# EAGLE design AB+RADIO (EAGLE 9.4.2)
ESKD_DESCRIPTION1: 207|235|224|242|224|32|192|193; ESKD_DESCRIPTION2: 241|245|229|236|224|32|253|235|229|234|242|240|232|247|229|241|234|224|255; ESKD_DESCRIPTION3: 239|240|232|237|246|232|239|232|224|235|252|237|224|255; ESKD_NUMBER: 67|67|83|50|46|51|50|48|48|45|48|221|51; ESKD_NUMBER_SHEET: 49; ESKD_SHEETS: 49
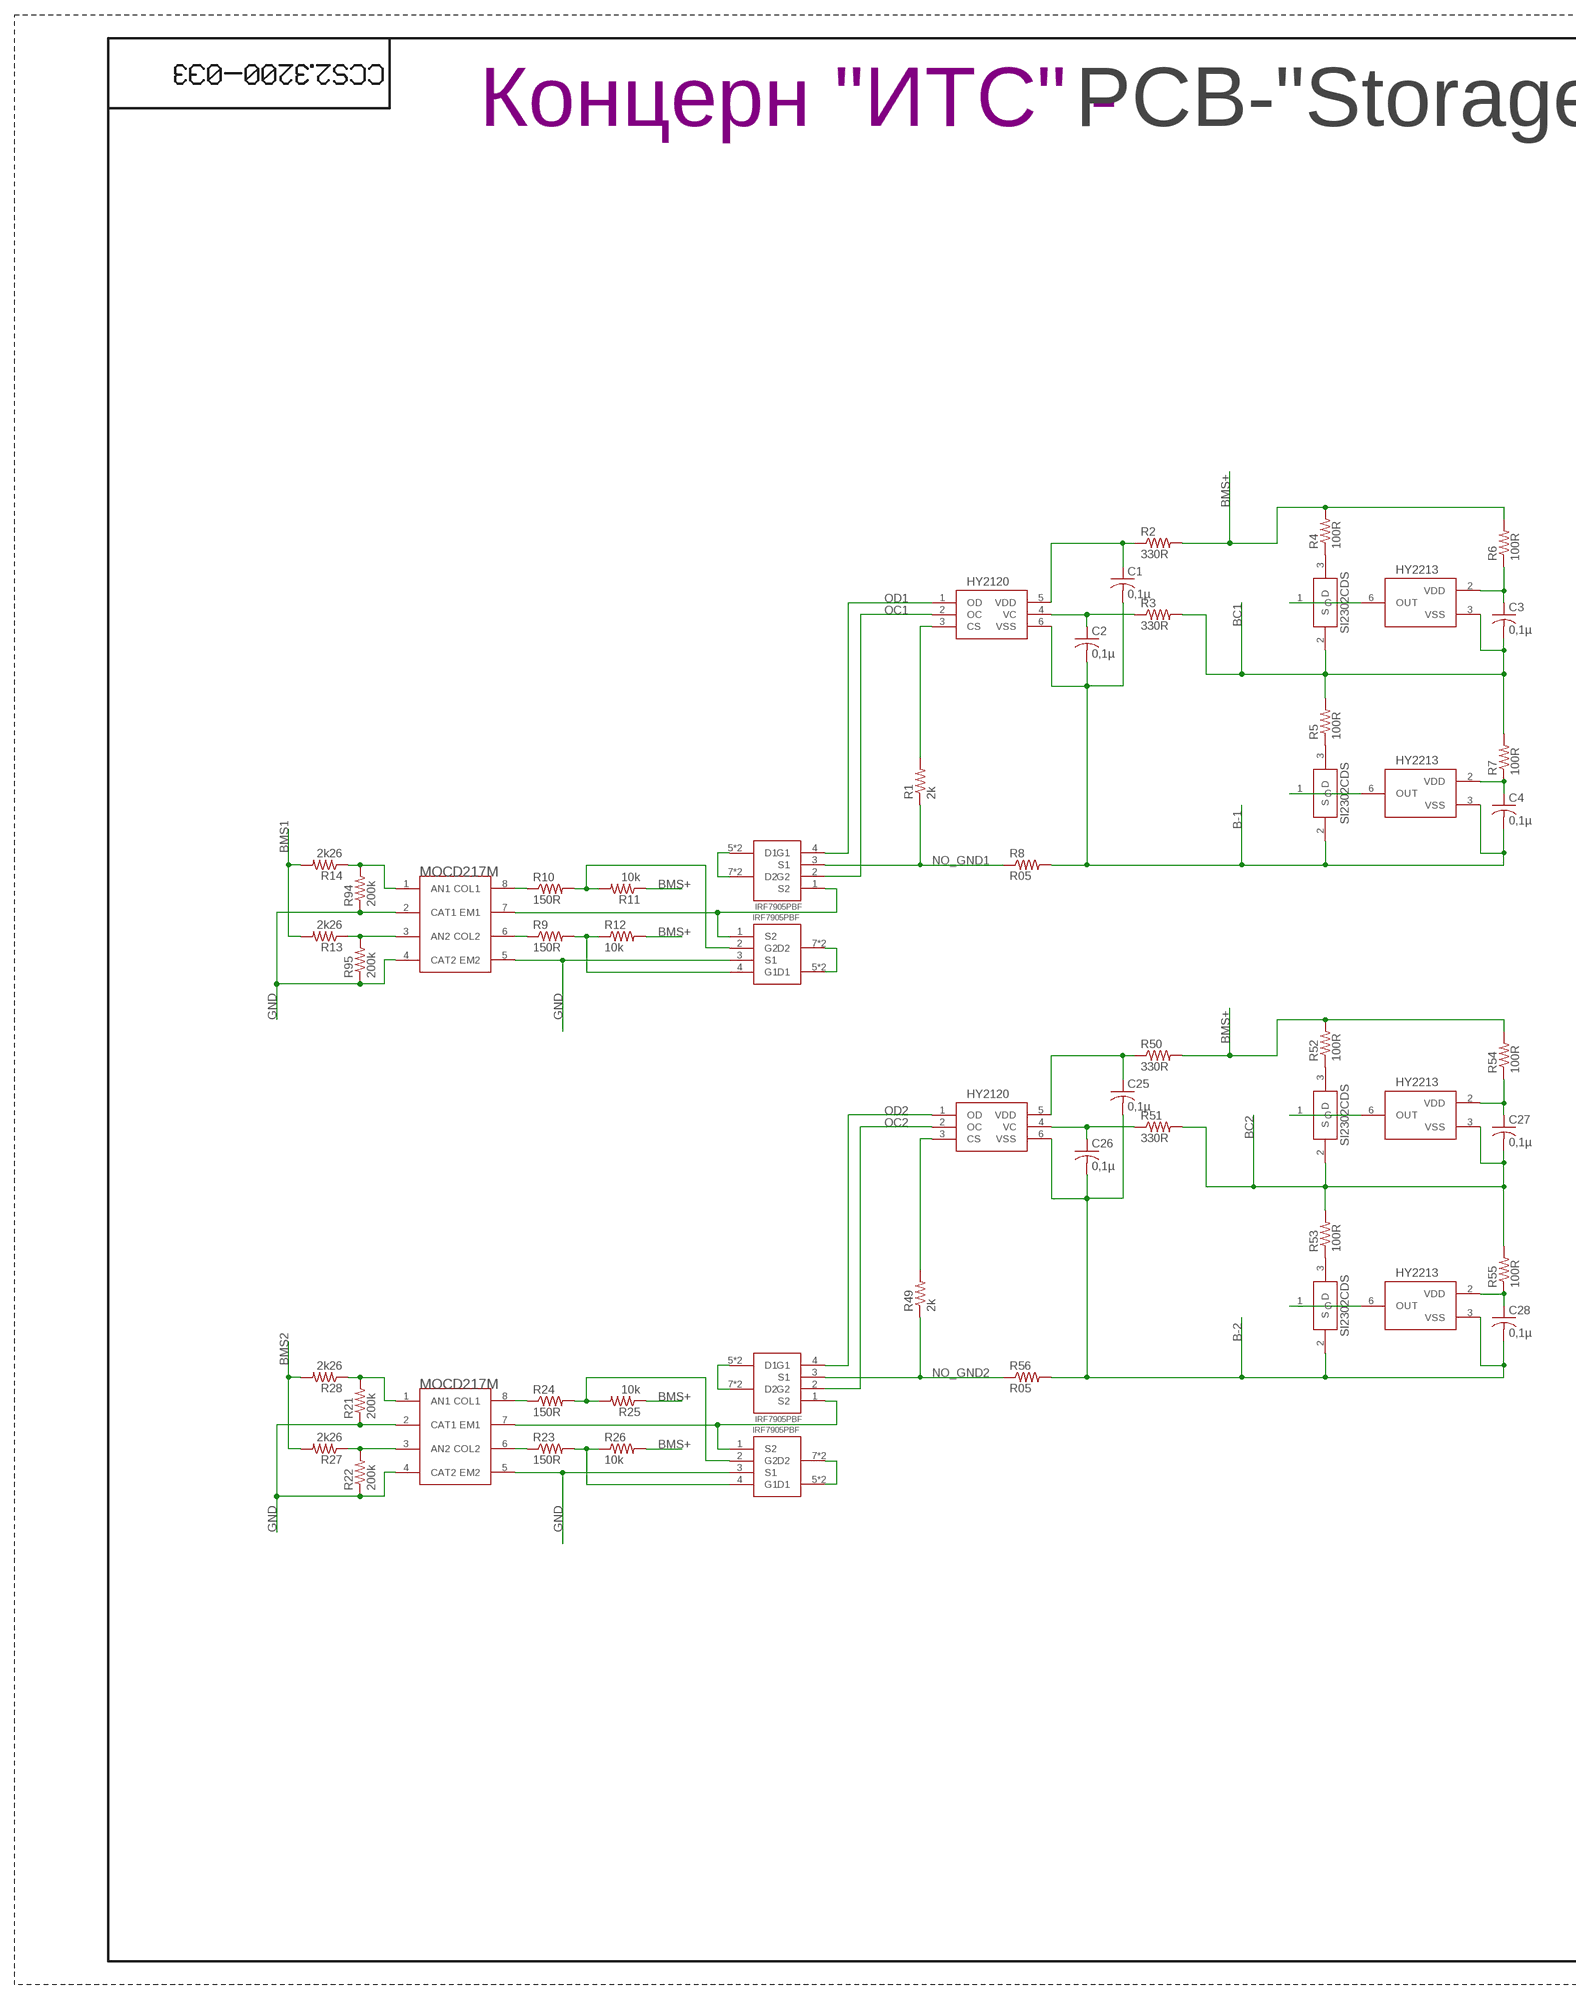
[diagram p0: schematic, sheet 1, part 1 of 2]
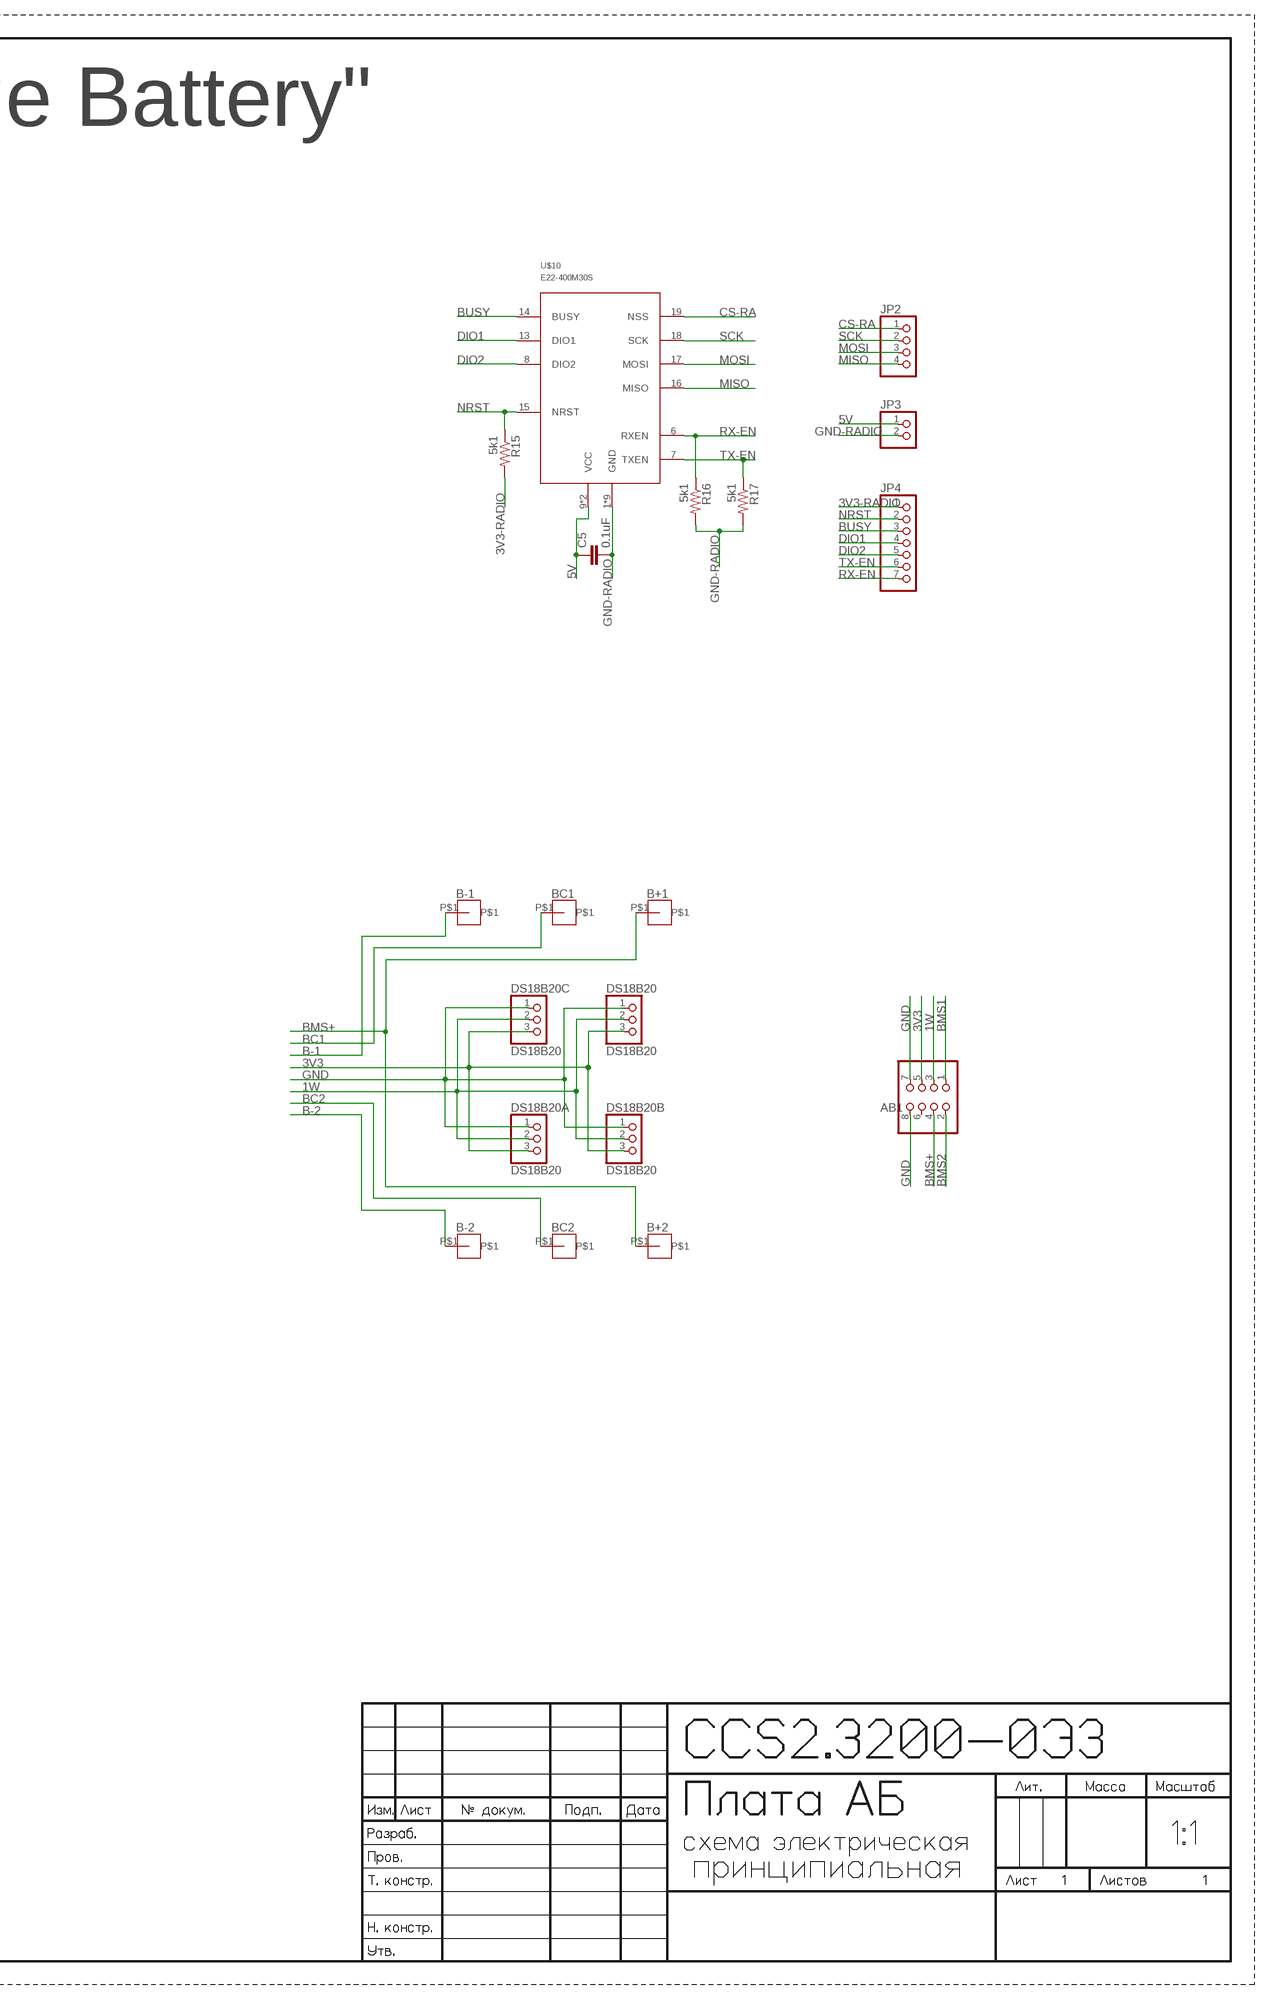
[diagram p1: schematic, sheet 1, part 2 of 2]

## Parts
AB1  PINHD-2X4  [2X04]
B+1  BATTERY  [BATTERY]
B+2  BATTERY  [BATTERY]
B-1  BATTERY  [BATTERY]
B-2  BATTERY  [BATTERY]
BC1  BATTERY  [BATTERY]
BC2  BATTERY  [BATTERY]
C1  0,1µ  C-USC0603  [C0603]
C2  0,1µ  C-USC0603  [C0603]
C3  0,1µ  C-USC0603  [C0603]
C4  0,1µ  C-USC0603  [C0603]
C5  0.1uF  C-EUC0603  [C0603]
C25  0,1µ  C-USC0603  [C0603]
C26  0,1µ  C-USC0603  [C0603]
C27  0,1µ  C-USC0603  [C0603]
C28  0,1µ  C-USC0603  [C0603]
DS18B20  DS18B20  CONNECT1X3  [CONNECT1X3]
DS18B20A  DS18B20  CONNECT1X3  [CONNECT1X3]
DS18B20B  DS18B20  CONNECT1X3  [CONNECT1X3]
DS18B20C  DS18B20  CONNECT1X3  [CONNECT1X3]
JP2  PINHD-1X4  [1X04]
JP3  PINHD-1X2  [1X02]
JP4  PINHD-1X7  [1X07]
R1  2k  R-US_R0603  [R0603]
R2  330R  R-US_R0603  [R0603]
R3  330R  R-US_R0603  [R0603]
R4  100R  R-US_R0603  [R0603]
R5  100R  R-US_R0603  [R0603]
R6  100R  R-US_R0603  [R0603]
R7  100R  R-US_R0603  [R0603]
R8  R05  R-US_R2512  [R2512]
R9  150R  R-US_R0603  [R0603]
R10  150R  R-US_R0603  [R0603]
R11  10k  R-US_R0603  [R0603]
R12  10k  R-US_R0603  [R0603]
R13  2k26  R-US_R0603  [R0603]
R14  2k26  R-US_R0603  [R0603]
R15  5k1  R-US_R0603  [R0603]
R16  5k1  R-US_R0603  [R0603]
R17  5k1  R-US_R0603  [R0603]
R21  200k  R-US_R0603  [R0603]
R22  200k  R-US_R0603  [R0603]
R23  150R  R-US_R0603  [R0603]
R24  150R  R-US_R0603  [R0603]
R25  10k  R-US_R0603  [R0603]
R26  10k  R-US_R0603  [R0603]
R27  2k26  R-US_R0603  [R0603]
R28  2k26  R-US_R0603  [R0603]
R49  2k  R-US_R0603  [R0603]
R50  330R  R-US_R0603  [R0603]
R51  330R  R-US_R0603  [R0603]
R52  100R  R-US_R0603  [R0603]
R53  100R  R-US_R0603  [R0603]
R54  100R  R-US_R0603  [R0603]
R55  100R  R-US_R0603  [R0603]
R56  R05  R-US_R2512  [R2512]
R94  200k  R-US_R0603  [R0603]
R95  200k  R-US_R0603  [R0603]
U$1  PCB-"Storage Battery"  ITS-LOGOPCB-""  [ITS-LOGO]
U$2  MOCD217M  [SOIC8]
U$3  HY2120  [SOT23-6]
U$4  HY2213"  [SOT23-6]
U$5  HY2213"  [SOT23-6]
U$6  SI2302CDS  [SOT23-3]
U$7  SI2302CDS  [SOT23-3]
U$8  IRF7905PBF  [SO8]
U$9  IRF7905PBF  [SO8]
U$10  E22-400M30S  [E22-400M30S]
U$11  MOCD217M  [SOIC8]
U$12  IRF7905PBF  [SO8]
U$13  IRF7905PBF  [SO8]
U$45  HY2120  [SOT23-6]
U$46  HY2213"  [SOT23-6]
U$47  HY2213"  [SOT23-6]
U$48  SI2302CDS  [SOT23-3]
U$49  SI2302CDS  [SOT23-3]

## Nets
1W: AB1.3 DS18B20.2 DS18B20A.2 DS18B20B.2 DS18B20C.2
3V3: AB1.5 DS18B20.3 DS18B20A.3 DS18B20B.3 DS18B20C.3
3V3-RADIO: JP4.1 R15.2
5V: C5.1 JP3.1 U$10.9(VCC) U$10.10(VCC)
B-1: B-1.P$1 C1.2 C2.2 C4.2 R8.2 U$3.6(VSS) U$5.3(VSS) U$7.2(S)
B-2: B-2.P$1 C25.2 C26.2 C28.2 R56.2 U$45.6(VSS) U$47.3(VSS) U$49.2(S)
BC1: BC1.P$1 C3.2 R3.2 R5.2 R7.2 U$4.3(VSS) U$6.2(S)
BC2: BC2.P$1 C27.2 R51.2 R53.2 R55.2 U$46.3(VSS) U$48.2(S)
BMS1: AB1.1 R13.2 R14.2
BMS2: AB1.2 R27.2 R28.2
BMS+: AB1.4 B+1.P$1 B+2.P$1 R2.2 R4.2 R6.2 R11.1 R12.2 R25.1 R26.2 R50.2 R52.2 R54.2
BUSY: JP4.3 U$10.14(BUSY)
CS-RA: JP2.1 U$10.19(NSS)
DIO1: JP4.4 U$10.13(DIO1)
DIO2: JP4.5 U$10.8(DIO2)
GND: AB1.7 AB1.8 DS18B20.1 DS18B20A.1 DS18B20B.1 DS18B20C.1 R21.1 R22.1 R94.1 R95.1 U$2.2(CAT1) U$2.4(CAT2) U$2.5(EM2) U$8.3(S1) U$11.2(CAT1) U$11.4(CAT2) U$11.5(EM2) U$12.3(S1)
GND-RADIO: C5.2 JP3.2 R16.2 R17.2 U$10.1(GND) U$10.2(GND) U$10.3(GND) U$10.4(GND) U$10.5(GND) U$10.11(GND) U$10.12(GND) U$10.20(GND) U$10.22(GND)
MISO: JP2.4 U$10.16(MISO)
MOSI: JP2.3 U$10.17(MOSI)
N$1: U$2.7(EM1) U$8.1(S2) U$9.1(S2)
N$2: R10.2 R11.2 U$8.2(G2)
N$3: R49.2 U$45.3(CS)
N$4: C1.1 R2.1 U$3.5(VDD)
N$6: C3.1 R6.1 U$4.2(VDD)
N$7: U$4.6(OUT) U$6.1(G)
N$8: C4.1 R7.1 U$5.2(VDD)
N$9: U$5.6(OUT) U$7.1(G)
N$11: R4.1 U$6.3(D)
N$12: R5.1 U$7.3(D)
N$13: R1.2 U$3.3(CS)
N$15: C2.1 R3.1 U$3.4(VC)
N$16: U$9.5(D1) U$9.6(D1) U$9.7(D2) U$9.8(D2)
N$17: R10.1 U$2.8(COL1)
N$18: R13.1 R95.2 U$2.3(AN2)
N$20: R22.2 R27.1 U$11.3(AN2)
N$21: U$8.5(D1) U$8.6(D1) U$8.7(D2) U$8.8(D2)
N$22: R9.1 U$2.6(COL2)
N$23: R9.2 R12.1 U$8.4(G1)
N$24: R21.2 R28.1 U$11.1(AN1)
N$25: R14.1 R94.2 U$2.1(AN1)
N$26: R24.2 R25.2 U$12.2(G2)
N$27: R24.1 U$11.8(COL1)
N$28: R23.1 U$11.6(COL2)
N$29: R23.2 R26.1 U$12.4(G1)
N$30: U$11.7(EM1) U$12.1(S2) U$13.1(S2)
N$31: U$13.5(D1) U$13.6(D1) U$13.7(D2) U$13.8(D2)
N$32: U$12.5(D1) U$12.6(D1) U$12.7(D2) U$12.8(D2)
N$71: R52.1 U$48.3(D)
N$85: R53.1 U$49.3(D)
N$97: C25.1 R50.1 U$45.5(VDD)
N$99: C27.1 R54.1 U$46.2(VDD)
N$100: U$46.6(OUT) U$48.1(G)
N$102: U$47.6(OUT) U$49.1(G)
N$107: C26.1 R51.1 U$45.4(VC)
N$108: C28.1 R55.1 U$47.2(VDD)
NO_GND1: R1.1 R8.1 U$9.3(S1)
NO_GND2: R49.1 R56.1 U$13.3(S1)
NRST: JP4.2 R15.1 U$10.15(NRST)
OC1: U$3.2(OC) U$9.2(G2)
OC2: U$13.2(G2) U$45.2(OC)
OD1: U$3.1(OD) U$9.4(G1)
OD2: U$13.4(G1) U$45.1(OD)
RX-EN: JP4.7 R16.1 U$10.6(RXEN)
SCK: JP2.2 U$10.18(SCK)
TX-EN: JP4.6 R17.1 U$10.7(TXEN)
Unconnected: AB1.6

## Library data of the parts
AB1 = pinheadCS:PINHD-2X4: PIN HEADER
B+1 B+2 B-1 B-2 BC1 BC2 = CanCubeSat:BATTERY
C1-C4 C25-C28 = rcl:C-US: CAPACITOR, American symbol; SPICEPREFIX: C
C5 = rcl:C-EU: CAPACITOR, European symbol; SPICEPREFIX: C
DS18B20 DS18B20A DS18B20B DS18B20C = CanCubeSat:CONNECT1X3
JP2 = pinhead:PINHD-1X4: PIN HEADER
JP3 = pinhead:PINHD-1X2: PIN HEADER
JP4 = pinhead:PINHD-1X7: PIN HEADER
R1-R7 R9-R17 R21-R28 R49-R55 R94 R95 = resistor:R-US_: RESISTOR, American symbol
R8 R56 = rcl:R-US_: RESISTOR, American symbol; SPICEPREFIX: R
U$1 = CanCubeSat:ITS-LOGO
U$2 U$11 = CanCubeSat:MOCD217M
U$3 U$45 = CanCubeSat:HY2120
U$4 U$5 U$46 U$47 = CanCubeSat:HY2213
U$6 U$7 U$48 U$49 = CanCubeSat:SI2302CDS
U$8 U$9 U$12 U$13 = CanCubeSat:IRF7905PBF
U$10 = CanCubeSat:E22-400M30S: EBYTE E22400M30S radio module Datasheet and info: http://www.ebyte.com/en/product-view-news.aspx?id=454

## Board
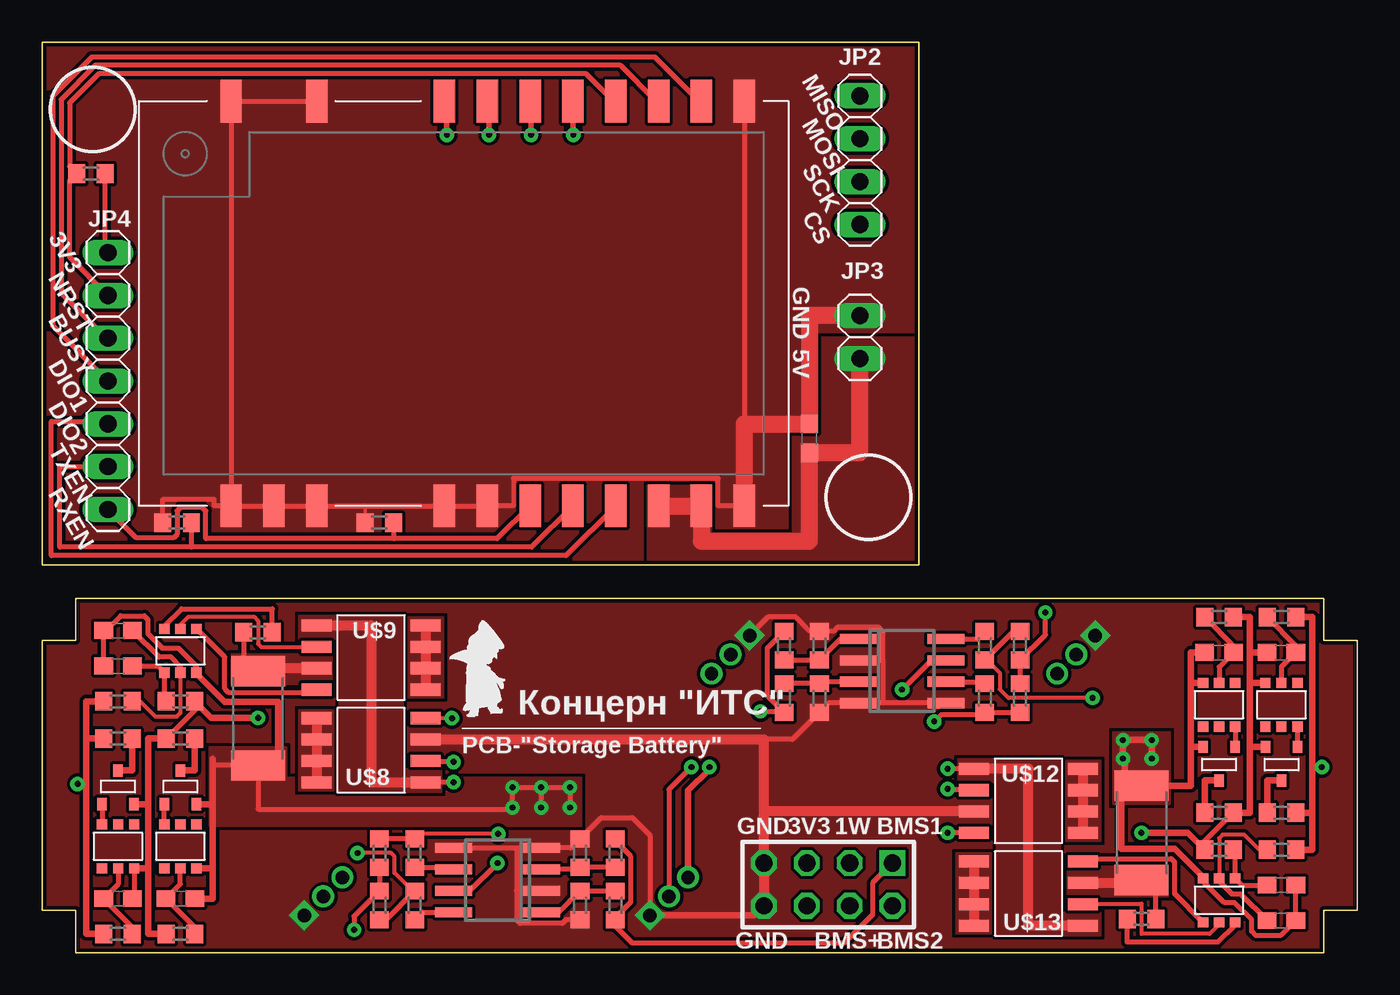
[diagram p2: board, top side]
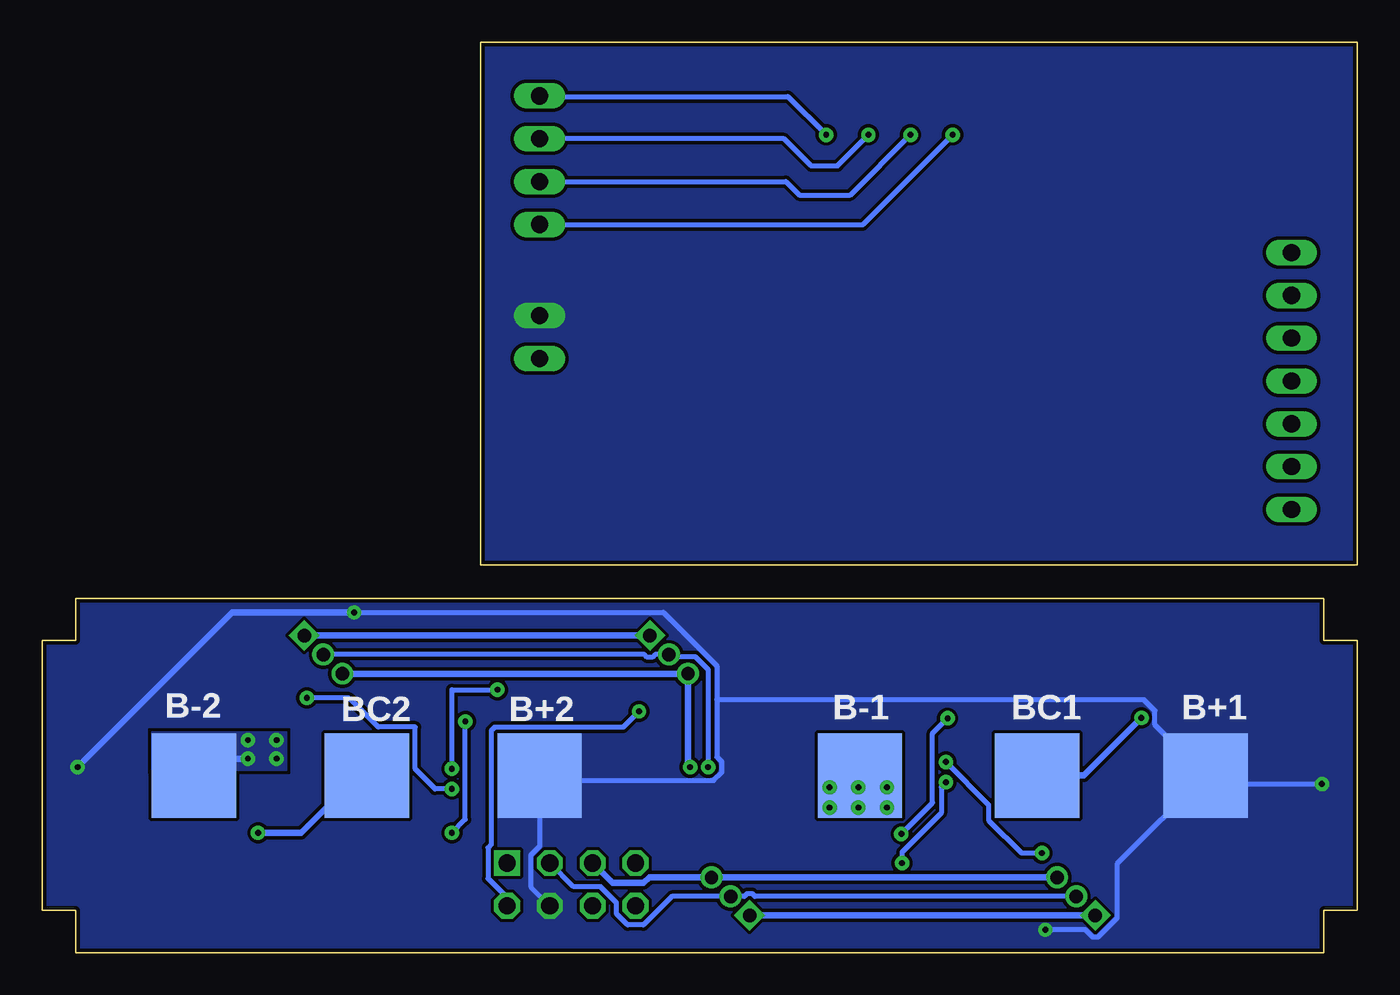
[diagram p3: board, bottom side, seen from below]

Size 78 x 54 mm. Coordinates in mm from the lower left corner, seen from the top.
Outline: 76,0 76,2.5 78,2.5 78,18.5 76,18.5 76,21 2,21 2,18.5 0,18.5 0,2.5 2,2.5 2,0 76,0
Outline: 0,23 0,54 52,54 52,23 0,23
Copper layers (1*16): Top 0.035mm / dielectric 1.5mm / Bottom 0.035mm
Design rules "default *": minimum track width 0.2mm, minimum drill 0.35mm, track to track 0.2mm, track to pad 0.2mm, pad to pad 0.2mm, via to via 0.2mm, smd to smd 0.2mm, copper to edge 0.2mm, drill to drill 8mil, minimum pad ring 0.25mm, minimum via ring 0.25mm, stop-mask expansion 4mil, vias tented up to drill 0mil, thermal gap 10mil

### Footprints (pad centres in the part's own frame; a part is rotated, then mirrored left to right if it is on the bottom)
2X04 = drill 1.016 square: 1 -3.81,-1.27 | drill 1.016 octagon: 2 -3.81,1.27; 3 -1.27,-1.27; 4 -1.27,1.27; 5 1.27,-1.27; 6 1.27,1.27; 7 3.81,-1.27; 8 3.81,1.27
BATTERY = smd 5 x 5: P$1 0,0
C0603 = smd 1.1 x 1: 1 -0.85,0; 2 0.85,0
CONNECT1X3 = drill 0.8 pad 1.2 square: 1 -1.6,0 | drill 0.8 pad 1.2: 2 0,0; 3 1.6,0
1X04 = drill 1.016 long: 1 -3.81,0; 2 -1.27,0; 3 1.27,0; 4 3.81,0
1X02 = drill 1.016 long: 1 -1.27,0; 2 1.27,0
1X07 = drill 1.016 long: 1 -7.62,0; 2 -5.08,0; 3 -2.54,0; 4 0,0; 5 2.54,0; 6 5.08,0; 7 7.62,0
R0603 = smd 1 x 1.1: 1 -0.85,0; 2 0.85,0
R2512 = smd 1.8 x 3.2: 1 -2.8,0; 2 2.8,0
SOIC8 = smd 0.6 x 2.2: 1 -1.905,-2.6; 2 -0.635,-2.6; 3 0.635,-2.6; 4 1.905,-2.6; 5 1.905,2.6; 6 0.635,2.6; 7 -0.635,2.6; 8 -1.905,2.6
SOT23-6 = smd 0.6 x 0.6: 1 -0.95,-1.3; 2 0,-1.3; 3 0.95,-1.3; 4 0.95,1.3; 5 0,1.3; 6 -0.95,1.3
SOT23-3 = smd 0.56 x 0.73: 1 -0.95,-1; 2 0.95,-1; 3 0,1
SO8 = smd 0.72 x 1.78: 1 -1.905,-3.23; 2 -0.635,-3.23; 3 0.635,-3.23; 4 1.905,-3.23; 5 1.905,3.23; 6 0.635,3.23; 7 -0.635,3.23; 8 -1.905,3.23
E22-400M30S = smd 2.54 x 1.27: 1 12,-13.79; 2 12,-11.25; 3 12,-8.71; 4 12,-1.14; 5 12,1.4; 6 12,3.94; 7 12,6.48; 8 12,9.02; 9 12,11.56; 10 12,14.1; 11 12,16.64; 12 -12,16.64; 13 -12,14.1; 14 -12,11.56; 15 -12,9.02; 16 -12,6.48; 17 -12,3.94; 18 -12,1.4; 19 -12,-1.14; 20 -12,-8.71; 22 -12,-13.79

### Placement (x,y rotation side)
AB1  46.62,4.04 180 top
B+1  9,10.5 0 bottom
B+2  48.5,10.5 0 bottom
B-1  29.5,10.5 0 bottom
B-2  69,10.5 0 bottom
BC1  19,10.5 0 bottom
BC2  58.75,10.5 0 bottom
C1  4.5,19.1 180 top
C2  4.5,17 180 top
C3  4.5,3.2 0 top
C4  8.2,3.2 0 top
C5  45.5,30.5 90 top
C25  73.5,1.9 0 top
C26  73.5,4 0 top
C27  73.5,17.8 180 top
C28  69.8,17.8 180 top
DS18B20  37.17,3.33 45 top
DS18B20A  40.83,17.67 225 top
DS18B20B  16.67,3.33 45 top
DS18B20C  61.33,17.67 225 top
JP2  48.5,47 90 top
JP3  48.5,36.5 90 top
JP4  3.9,33.9 270 top
R1  12.8,19 0 top
R2  4.5,14.9 180 top
R3  8.2,14.9 0 top
R4  4.5,12.7 180 top
R5  8.2,12.7 180 top
R6  4.5,1.1 180 top
R7  8.2,1.1 180 top
R8  12.8,13.9 270 top
R9  22.1,5.9 90 top
R10  22.1,2.8 90 top
R11  20,2.8 270 top
R12  20,5.9 270 top
R13  34,5.9 90 top
R14  34,2.8 270 top
R15  2.9,46.2 0 top
R16  20,25.5 180 top
R17  8,25.5 180 top
R21  46.1,18.2 270 top
R22  46.1,15.1 90 top
R23  55.9,15.1 270 top
R24  55.9,18.2 270 top
R25  58,18.2 90 top
R26  58,15.1 90 top
R27  44,15.1 270 top
R28  44,18.2 90 top
R49  65.2,2 180 top
R50  73.5,6.1 0 top
R51  69.8,6.1 180 top
R52  73.5,8.3 0 top
R53  69.8,8.3 0 top
R54  73.5,19.9 0 top
R55  69.8,19.9 0 top
R56  65.2,7.1 90 top
R94  31.9,2.8 90 top
R95  31.9,5.9 270 top
U$1  24.9,13.3 0 top
U$2  27,4.3 90 top
U$3  8.2,17.9 180 top
U$4  4.5,6.3 0 top
U$5  8.2,6.3 0 top
U$6  4.5,9.8 0 top
U$7  8.2,9.8 0 top
U$8  19.5,12 90 top
U$9  19.5,17.5 270 top
U$10  25,38.5 270 top
U$11  51,16.7 270 top
U$12  58.5,9 270 top
U$13  58.5,3.5 90 top
U$45  69.8,3.1 0 top
U$46  73.5,14.7 180 top
U$47  69.8,14.7 180 top
U$48  73.5,11.2 180 top
U$49  69.8,11.2 180 top

### Tracks (layer width: path | path; a pad name or v marks a point on that pad's centre or on a via)
1W  (via drill 0.35)
  Top 0.3: v38.5,11 37.17,9.67 DS18B20.2
  Bottom 0.3: DS18B20B.2 35.73,3.33 35.89,3.49 36.19,3.49 36.35,3.33 DS18B20.2 40.65,3.33 42.34,1.64 43.28,1.64 43.94,2.3 43.94,2.96 44.88,3.9 46.48,3.9 AB1.3 | DS18B20C.2 42.27,17.67 42.11,17.51 41.81,17.51 41.65,17.67 DS18B20A.2 40.72,17.56 39.27,17.56 38.5,16.79 v38.5,11
3V3  (via drill 0.35)
  Top 0.4: v39.57,11 39.57,10.88 38.3,9.61 DS18B20.3
  Bottom 0.4: DS18B20B.3 DS18B20.3 41.99,4.46 42.32,4.13 44.17,4.13 AB1.5 | DS18B20C.3 DS18B20A.3 39.7,11.13 v39.57,11
3V3-RADIO
  Top 0.3: R15.2 3.75,41.67 JP4.1
5V
  Top 1: U$10.9 U$10.10 39.1,24.4 45.5,24.4 C5.1 48.5,29.65 JP3.1
  pour Top (no thermals): 52,36.5 52,23 35.9,23 35.9,27.7 39.7,27.7 39.7,24.9 44.5,24.9 44.5,30.9 46,30.9 46,36.5
B-1  (via drill 0.35)
  Top 0.3: C2.2 C1.2 3.78,19.1 4.65,19.97 6.05,19.97 6.27,19.75 6.27,18.91 7.14,18.04 8.08,18.04 9.15,16.97 U$3.6 | 10.1,11.5 10.1,11.1 R8.2 12.8,8.5 27.9,8.5 v27.9,8.6 v27.9,9.8 v29.6,9.8 | v29.6,9.8 v29.6,8.6 | v29.6,9.8 v31.3,9.8 v31.3,8.6
  Top 0.4: C4.2 10.1,3.2 10.1,5 | 10.1,5 10.1,8.8 | U$5.3 10.1,5 | U$7.2 10.1,8.8 | 10.1,11.5 10.1,8.8 | R8.2 14,11.1 14,14.86 10.81,14.86 9.15,16.52 U$3.6
  Bottom 0.3: B-1.P$1 29.6,10.4 v29.6,9.8
  pour Top (rank 3, no thermals): 32,7.5 32,10.4 14.5,10.4 14.5,12.2 9.9,12.2 9.9,7.5
B-2  (via drill 0.35)
  Top 0.3: C26.2 C25.2 73.48,1.03 71.95,1.03 71.73,1.25 71.73,1.94 70.71,2.96 70.12,2.96 68.85,4.23 U$45.6
  Top 0.4: C28.2 68.13,17.8 68.13,16 | U$49.2 68.13,12.2 | 68.13,16 68.13,12.2 | U$47.3 68.13,16 | 68.13,12.2 68.13,9.9 R56.2 | U$45.6 68.85,4.48 67.19,6.14 64,6.14 64,9.9 R56.2 | v65.8,11.5 v65.8,12.6 v64.1,12.6 v64.1,11.5 64.2,11.4 64.2,9.9 R56.2
  Bottom 0.4: v65.8,11.5 69,11.5 B-2.P$1
  pour Top (no thermals): 66.9,13.1 63.5,13.1 63.5,8.8 66.9,8.8
  pour Bottom (no thermals): 63.5,13.1 71.5,13.1 71.5,10.8 63.5,10.8
BC1  (via drill 0.35)
  Top 0.3: R3.2 9.05,14.36 7.39,12.7 R5.2 | U$4.3 5.45,3.2 C3.2
  Top 0.4: R7.2 6.3,1.1 6.3,5 | 6.3,5 6.3,8.8 | 6.3,8.8 6.3,12.7 R5.2 | U$6.2 6.3,8.8 | U$4.3 6.3,5 | R3.2 10.04,13.91 v12.8,13.91
  Bottom 0.4: v12.8,13.91 16.21,10.5 BC1.P$1
BC2  (via drill 0.35)
  Top 0.3: R51.2 68.95,6.64 70.61,8.3 R53.2
  Top 0.4: R55.2 71.62,19.9 71.62,17.8 | C27.2 71.62,17.8 | 71.62,17.8 71.62,16 | U$46.3 71.62,16 | 71.62,16 71.62,12.2 | 71.62,12.2 U$48.2 | 71.62,12.2 71.62,8.3 R53.2 | R51.2 67.95,7.1 v65.2,7.1
  Bottom 0.4: v65.2,7.1 62.65,7.1 59.25,10.5 BC2.P$1
BMS1
  Top 0.3: R13.2 34,6.62 34.92,5.7 34.92,3 34,2.08 R14.2 34,1.55 35,0.55 47.55,0.55 49.25,2.25 49.25,4.13 AB1.1
BMS2  (via drill 0.35)
  Top 0.3: R28.2 43,18.05 43,15.25 R27.2 43.95,14.3 v42.6,14.3
  Bottom 0.3: AB1.2 50.43,3.26 51.56,4.39 51.56,6.22 51.37,6.42 51.37,13.15 51.15,13.37 43.53,13.37 v42.6,14.3
BMS+  (via drill 0.35)
  Top 0.3: R12.2 R11.1 18.5,2.15 v18.5,1.35 | R26.2 R25.1 59.5,18.85 v59.5,20.18 | v2.1,10 2.6,10
  Top 0.4: R4.2 2.6,12.7 | 2.6,12.7 2.6,10 2.6,1.1 R6.2 | R2.2 2.6,14.9 2.6,12.7 | R54.2 75.32,19.9 75.32,11 | R52.2 75.32,8.3 | 75.32,11 75.32,8.3 | 75.32,8.3 75.32,6.1 R50.2 | 75.32,11 v75.9,11
  Bottom 0.3: v59.5,20.18 41.15,20.18 37.98,17 37.98,15 | 37.98,15 37.98,11.6 37.7,11.33 37.7,10.67 38.17,10.21 48.2,10.21 B+2.P$1 48.5,6.3 49.02,5.78 49.02,3.9 AB1.4 | B+1.P$1 12.01,13.51 12.01,14.34 12.66,15 37.98,15 | B+1.P$1 8.5,10 v2.1,10 | B+1.P$1 14.25,5.25 14.25,2.04 15.39,0.91 15.69,0.91 16.14,1.35 v18.5,1.35
  Bottom 0.4: v75.9,11 66.72,20.18 v59.5,20.18
  pour Bottom (rank 4, no thermals): 0,18.5 2,18.5 2,21 76,21 76,18.5 78,18.5 78,2.5 76,2.5 76,0 2,0 2,2.5 0,2.5
BUSY
  Top 0.3: U$10.14 36.42,50.5 34.3,52.62 3.15,52.62 1.13,50.6 1.13,39.12 3.81,36.44 JP4.3
CS-RA  (via drill 0.35)
  Top 0.34: U$10.19 24,50.36 v24,48.5
  Bottom 0.3: v24,48.5 29.33,43.17 48.48,43.17 JP2.1
DIO1
  Top 0.3: U$10.13 38.96,50.5 36.34,53.12 2.94,53.12 0.63,50.81 0.63,37.17 JP4.4
DIO2
  Top 0.3: U$10.8 31.07,23.55 0.55,23.55 0.55,31.5 3.76,31.5 JP4.5
GND
  Top 0.3: R94.1 31.08,1.95 30.85,1.73 28.35,1.73 28.13,1.94 28.13,3.67 | U$2.5 28.13,6.21 | 28.13,6.21 U$2.4 31.36,6.21 R95.1 33.15,8 35,8 36.04,6.96 DS18B20.1 | U$11.5 49.87,14.79 | 49.87,14.79 U$11.4 46.65,14.79 R22.1 44.48,12.63 42.81,12.63 | 49.87,17.34 49.87,19.06 49.65,19.27 47.15,19.27 46.92,19.05 R21.1 45.55,19.05 44.7,19.9 43.06,19.9 DS18B20A.1 | U$11.2 49.87,17.34 | 28.13,3.67 U$2.2 | 28.13,6.21 28.13,3.67 | 49.87,17.34 49.87,14.79
  Top 0.4: DS18B20.1 42.24,2.2 AB1.8
  Top 0.6: 42.81,8.37 AB1.7 AB1.8 | 42.81,8.37 42.81,12.63 U$8.3 | U$12.3 42.81,8.37
  Bottom 0.4: DS18B20B.1 DS18B20.1 | DS18B20A.1 DS18B20C.1
  pour Top (no thermals): 56.2,7.5 56.2,9.2 55.9,9.2 44,9.2 44,13 44,13.5 21.9,13.5 21.9,11.8 22,11.8 41.6,11.8 41.6,5.3 41.6,1.5 42.5,1.5 44,1.5 44,7.5
  pour Top (rank 4, no thermals): 0,18.5 2,18.5 2,21 76,21 76,18.5 78,18.5 78,2.5 76,2.5 76,0 2,0 2,2.5 0,2.5
GND-RADIO
  Top 0.2: R16.2 19.15,26.5
  Top 0.3: 11.5,26.5 U$10.1 10.2,26.5 10.2,26.9 7.15,26.9 R17.2 | 11.5,26.5 U$10.2 U$10.3 19.15,26.5 U$10.4 U$10.5 27.95,26.5 27.95,28.12 40.09,28.12 40.09,26.5 U$10.11 U$10.12 | U$10.20 U$10.22 11.21,26.79 11.5,26.5
  Top 1: U$10.11 41.64,31.35 C5.2 45.5,37.77 JP3.2
  pour Bottom (no thermals): 0,54 52,54 52,23 0,23
  pour Top (rank 2, no thermals): 0,54 52,54 52,23 0,23
MISO  (via drill 0.35)
  Top 0.34: U$10.16 31.5,50.48 v31.5,48.5
  Bottom 0.3: JP2.4 48.46,50.77 33.77,50.77 v31.5,48.5
MOSI  (via drill 0.35)
  Top 0.34: v29,48.5 29,50.44 U$10.17
  Bottom 0.3: v29,48.5 30.83,46.67 32.4,46.67 34,48.27 JP2.3
N$1  (via drill 0.35)
  Top 0.3: U$2.7 25.36,3.67 v27,5.3 | v24.4,10.1 U$8.1
  Top 0.6: U$9.1 19.5,19.41 19.5,10.1 U$8.1
  Bottom 0.3: v24.4,10.1 24.68,9.82 24.68,8.28 27,5.95 v27,5.3
  pour Top (rank 2, no thermals): 15.2,20 15.2,18.6 17.6,18.6 17.6,9.5 23.7,9.5 23.7,10.9 21.4,10.9 21.4,20
N$2  (via drill 0.35)
  Top 0.25: R10.2 21.96,3.65 20.89,4.72 20.89,5.69 20.68,5.91 v18.7,5.91 v18.7,5.9
  Top 0.3: R10.2 20.4,1.95 R11.2 | v24.4,11.3 22.8,11.3 U$8.2
  Bottom 0.3: v24.4,11.3 21.87,8.77 21.87,7.85 19.92,5.9 v18.7,5.9
N$3
  Top 0.3: R49.2 64.35,0.61 69.73,0.61 70.75,1.63 U$45.3
N$4
  Top 0.25: R2.1 5.81,14.9 6.71,14.01 7.99,14.01 8.2,14.21 8.2,15.58 8.2,15.59 U$3.5
  Top 0.3: C1.1 6.93,17.52 7.65,17.52 8.2,16.97 U$3.5
N$6
  Top 0.3: U$4.2 4.5,4.05 C3.1 5.35,1.5 R6.1
N$7
  Top 0.3: U$6.1 U$4.6
N$8
  Top 0.3: R7.1 9.05,1.5 C4.1 8.2,4.05 U$5.2
N$9
  Top 0.3: U$5.6 U$7.1
N$11
  Top 0.4: R4.1 5.35,10.8 U$6.3
N$12
  Top 0.4: R5.1 9.05,10.8 U$7.3
N$13
  Top 0.3: R1.2 13.65,20.39 8.27,20.39 7.25,19.37 U$3.3
N$15
  Top 0.3: C2.1 6.85,17 U$3.4 7.25,15 R3.1
N$16
  Top 0.6: U$9.8 U$9.5
  pour Top (no thermals): 21.7,19.9 23.8,19.9 23.8,15.1 21.7,15.1
N$17
  Top 0.3: R10.1 22.55,2.4 U$2.8
N$18
  Top 0.3: R13.1 R95.2 31.79,4.93 U$2.3
N$20
  Top 0.3: U$11.3 46.22,16.07 R22.2 R27.1
N$21
  Top 0.6: U$8.5 U$8.8
  pour Top (no thermals): 15.2,14.4 17.3,14.4 17.3,9.6 15.2,9.6
N$22
  Top 0.3: R9.1 24.29,5.05 U$2.6
N$23  (via drill 0.35)
  Top 0.25: U$8.4 v24.3,13.9 | v27.05,7.03 22.38,7.03 R9.2
  Top 0.3: R9.2 R12.1
  Bottom 0.3: v24.3,13.9 25.2,13.01 25.2,8.88 v27.05,7.03
N$24
  Top 0.3: R28.1 R21.2 47.35,18.61 U$11.1
N$25
  Top 0.3: U$2.1 30.64,2.4 R94.2 R14.1
N$26  (via drill 0.35)
  Top 0.25: v62.3,15.1 57.31,15.1 56.8,15.62 56.8,16.59 56.04,17.35 R24.2
  Top 0.3: R24.2 57.6,19.05 R25.2 | U$12.2 53.77,9.63 v53.7,9.7
  Bottom 0.3: v53.7,9.7 54.7,9.7 55.88,10.88 55.88,13.37 58.07,13.37 59.8,15.1 v62.3,15.1
N$27
  Top 0.3: U$11.8 55.45,18.61 R24.1
N$28
  Top 0.3: U$11.6 55.78,16.07 R23.1
N$29  (via drill 0.35)
  Top 0.3: R26.1 R23.2 55.77,14.12 53.33,14.12 v52.9,13.7 | U$12.4 v53.7,7.09 v53.7,7.1
  Bottom 0.3: v52.9,13.7 v52.91,13.7 52.91,7.89 v53.7,7.1
N$30  (via drill 0.35)
  Top 0.3: U$12.1 v53.7,10.9 | v51,15.59 52.74,17.34 U$11.7
  Top 0.6: U$13.1 58.5,1.59 58.5,10.9 U$12.1
  Bottom 0.3: v53.7,10.9 53.7,15.59 v51,15.59
  pour Top (rank 2, no thermals): 62.8,1 62.8,2.4 60.4,2.4 60.4,11.5 54.3,11.5 54.3,10.1 56.6,10.1 56.6,1
N$31
  Top 0.6: U$13.5 U$13.6 U$13.7 U$13.8
  pour Top (no thermals): 56.3,1.1 54.2,1.1 54.2,5.9 56.3,5.9
N$32
  Top 0.6: U$12.8 U$12.7 U$12.6 U$12.5
  pour Top (no thermals): 62.8,6.6 60.7,6.6 60.7,11.4 62.8,11.4
N$71
  Top 0.4: U$48.3 72.65,10.2 R52.1
N$85
  Top 0.4: U$49.3 68.95,10.2 R53.1
N$97
  Top 0.25: R50.1 72.19,6.1 71.29,7 70.5,7 70.01,7 69.8,6.79 U$45.5
  Top 0.3: C25.1 71.07,3.48 70.55,3.48 69.8,4.23 U$45.5
N$99
  Top 0.3: R54.1 74.35,18.2 C27.1 73.5,16.95 U$46.2
N$100
  Top 0.3: U$46.6 U$48.1
N$102
  Top 0.3: U$47.6 U$49.1
N$107
  Top 0.3: C26.1 71.15,4 U$45.4 70.75,6 R51.1
N$108
  Top 0.3: R55.1 70.65,18.2 C28.1 69.8,16.95 U$47.2
NO_GND1
  Top 0.3: R1.1 11.95,16.7 R8.1
  Top 0.6: U$9.3 12.96,16.86 R8.1
  pour Top (no thermals): 11.2,17.7 17.2,17.7 17.2,17.2 17.2,15.9 12.7,15.9 11.2,15.9
NO_GND2
  Top 0.3: R49.1 66.05,4.3 R56.1
  Top 0.6: U$13.3 65.2,4.13 R56.1
  pour Top (no thermals): 66.8,3.3 60.8,3.3 60.8,5.1 66.8,5.1
NRST
  Top 0.3: U$10.15 33.88,50.5 32.26,52.12 3.35,52.12 1.63,50.39 1.63,46.62 R15.1 1.63,45.78 1.63,41.25 JP4.2
OC1
  Top 0.25: U$9.2 16.24,18.11 13.01,18.11 12.8,18.31 12.8,19.68 12.59,19.89 8.67,19.89 8.2,19.42 U$3.2
OC2
  Top 0.25: U$13.2 61.73,2.9 65.2,2.9 65.2,1.1 69.24,1.1 69.8,1.66 U$45.2
OD1
  Top 0.3: U$3.1 10.83,17.52 10.83,15.65 11.05,15.43 16.11,15.43 U$9.4
OD2
  Top 0.3: U$13.4 61.9,5.57 66.95,5.57 67.17,5.35 67.17,3.48 U$45.1
RX-EN
  Top 0.3: U$10.6 26.99,24.55 20.85,24.55 | 20.85,24.55 9.7,24.55 9.7,26.2 9.49,26.4 8.21,26.4 8,26.2 8,24.8 7.79,24.6 5.58,24.6 JP4.7 | R16.1 20.85,24.55
SCK  (via drill 0.35)
  Top 0.34: U$10.18 26.5,50.4 v26.5,48.5
  Bottom 0.3: JP2.2 33.9,45.73 33.1,44.93 30.07,44.93 v26.5,48.5
TX-EN
  Top 0.3: JP4.6 1.05,28.82 1.05,24.05 8.85,24.05 | U$10.7 29.03,24.05 8.85,24.05 | R17.1 8.85,24.05

### Text on the board
tPlace: MISO | MOSI | SCK | CS | 3V3 | NRST | GND | BUSY | 5V | DIO1 | DIO2 | TXEN | RXEN
tNames: GND | 3V3 | 1W | BMS1 | GND | BMS+ | BMS2
tValues: HY2120 | IRF7905 | HY2213 | SI2302 | SI2302 | HY2213 | IRF7905 | HY2120